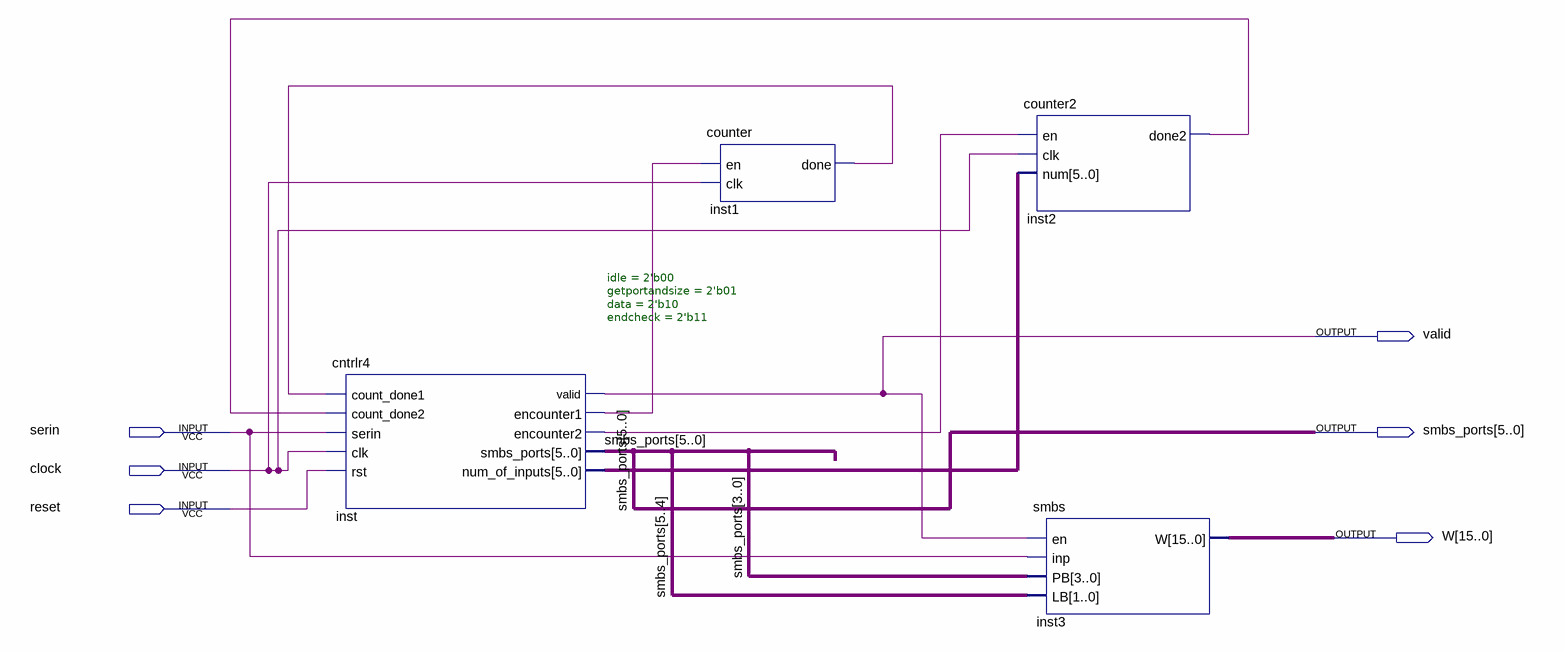
[diagram p0: schematic sheet]
// Quartus schematic ca5.bdf as structural Verilog: 4 symbols, 6 pins
module ca5 (
  input  serin,
  input  clock,
  input  reset,
  output valid,
  output [5:0] smbs_ports,
  output [15:0] W
);

  wire inst1_done, inst2_done2, inst_encounter1, inst_encounter2;
  wire [5:0] inst_num_of_inputs;

  cntrlr4 #(.idle(2'b00), .getportandsize(2'b01), .data(2'b10), .endcheck(2'b11)) inst (
    .count_done1(inst1_done), .count_done2(inst2_done2), .serin(serin), .clk(clock), .rst(reset),
    .valid(valid), .encounter1(inst_encounter1), .encounter2(inst_encounter2), .smbs_ports(smbs_ports),
    .num_of_inputs(inst_num_of_inputs));
  counter inst1 (.en(inst_encounter1), .clk(clock), .done(inst1_done));
  counter2 inst2 (.en(inst_encounter2), .clk(clock), .num(inst_num_of_inputs), .done2(inst2_done2));
  smbs inst3 (.en(valid), .inp(serin), .PB(smbs_ports[3:0]), .LB(smbs_ports[5:4]), .W(W));
endmodule
